# EAGLE design sherlock_anderson (EAGLE 6.5.0)
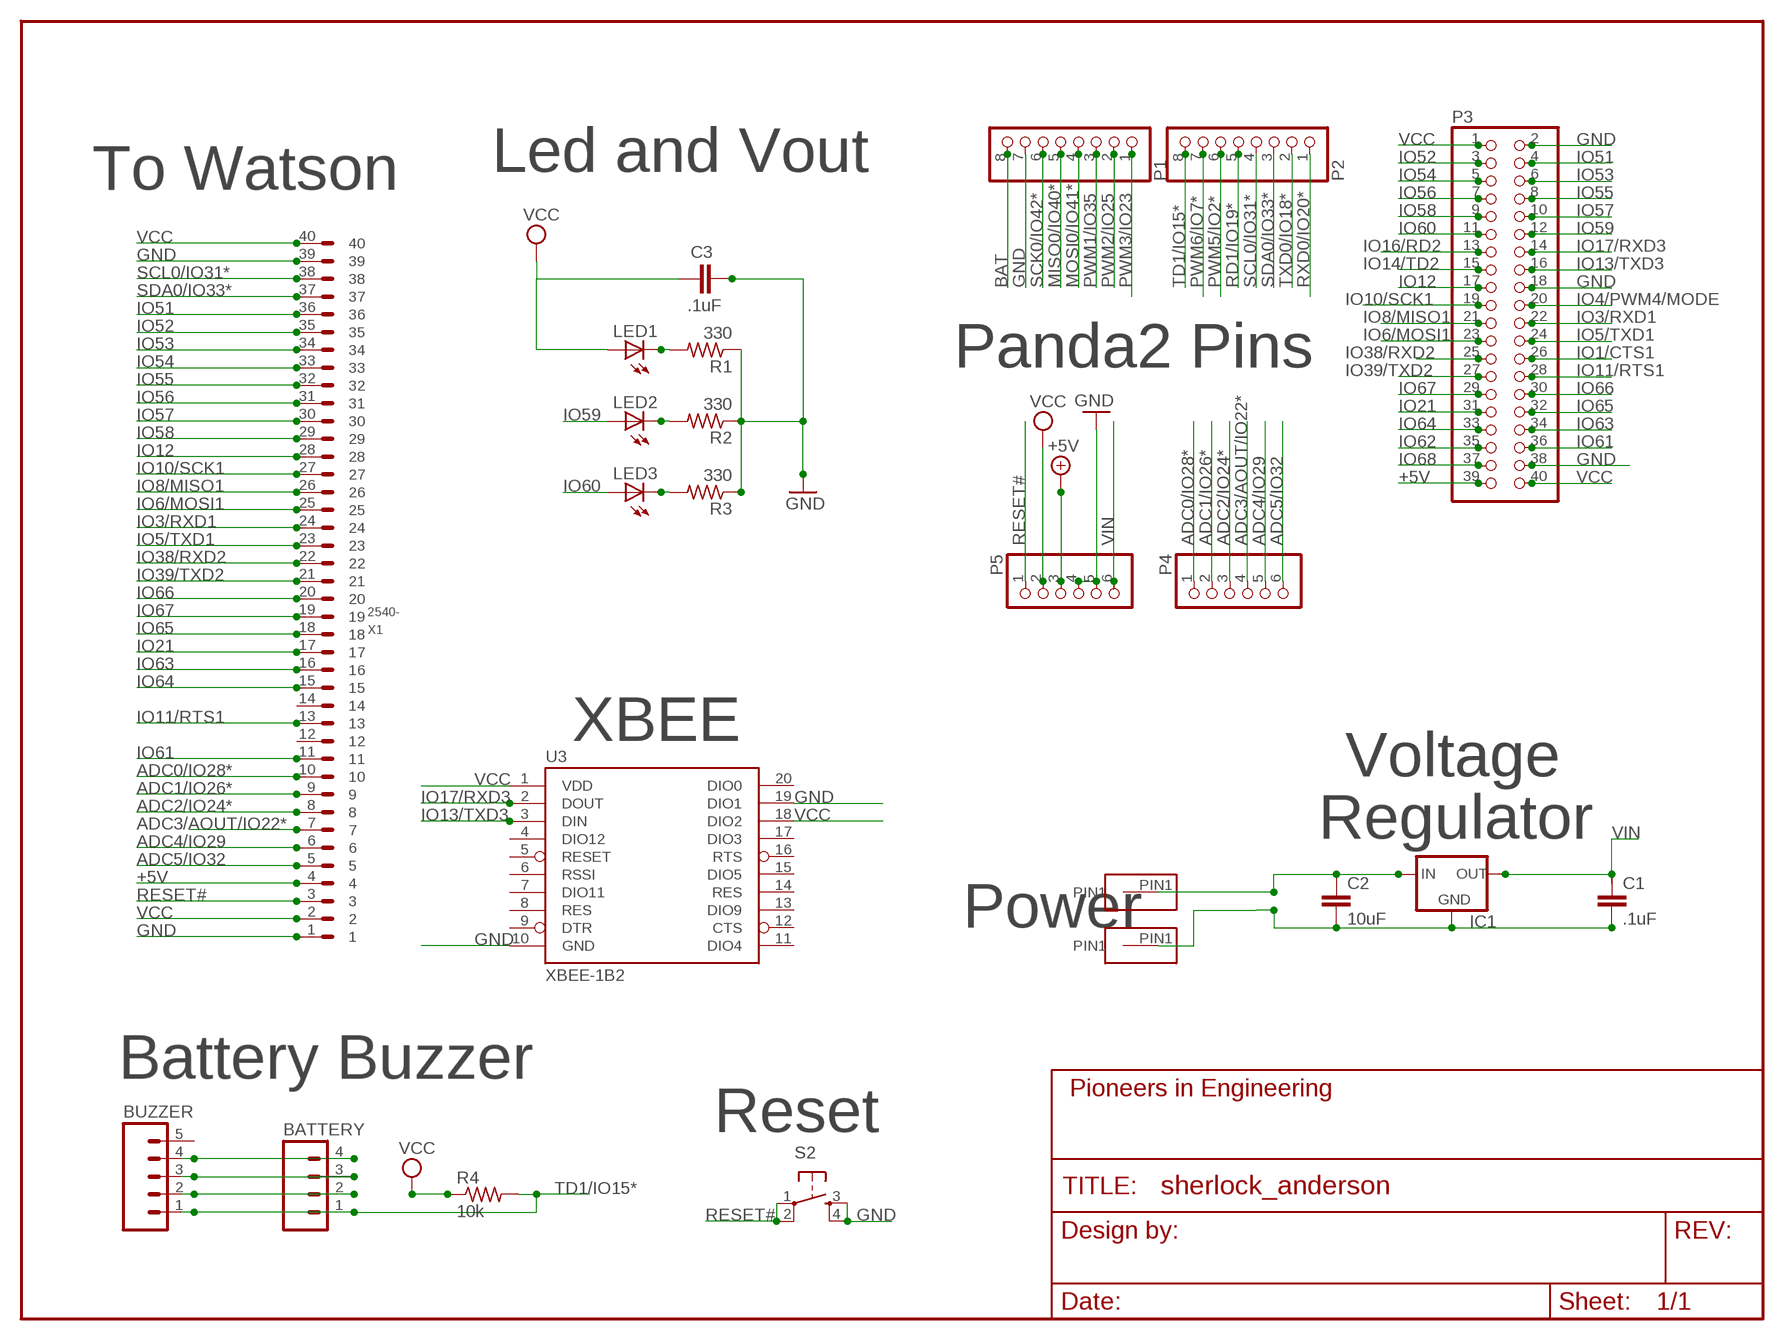
[diagram p0: schematic, sheet 1]
FRAME1 (FRAME-LETTER): AUTHOR: Sahar M., Michael C., Sumita G.; REVISION: F

## Parts
BATTERY  M041X04-MTA  [1X04-MTA]
BUZZER  M05PTH  [1X05]
C1  .1uF  CAP0603-CAP  [0603-CAP]
C2  10uF  CAP0603-CAP  [0603-CAP]
C3  .1uF  CAP0603-CAP  [0603-CAP]
IC1  V_REG_78XXSIDE  [78XXL]
LED1  LED0805  [LED-0805]
LED2  LED0805  [LED-0805]
LED3  LED0805  [LED-0805]
P1  PINHD-1X8  [1X08]
P2  PINHD-1X8  [1X08]
P3  PINHD-2X20  [2X20]
P4  PINHD-1X6  [1X06]
P5  PINHD-1X6  [1X06]
R1  330  R-US_R0603  [R0603]
R2  330  R-US_R0603  [R0603]
R3  330  R-US_R0603  [R0603]
R4  10k  R-US_R0603  [R0603]
S2  TAC_SWITCHPTH  [TACTILE-PTH]
U3  XBEE-1B2  [XBEE-SILK]
U$1  ANDERSON_RA_BOTTOM  [ANDERSON_RA_BOTTOM]
U$5  ANDERSON_RA_BOTTOM  [ANDERSON_RA_BOTTOM]
X1  2540-  [PAK100/2500-40]

## Nets
12V: C2.1 IC1.IN U$1.PIN1
+5V [power]: P3.39 P5.3 X1.4
ADC0/IO28*: P4.1 X1.10
ADC1/IO26*: P4.2 X1.9
ADC2/IO24*: P4.3 X1.8
ADC3/AOUT/IO22*: P4.4 X1.7
ADC4/IO29: P4.5 X1.6
ADC5/IO32: P4.6 X1.5
BAT: P1.8
GND: C1.2 C2.2 C3.2 IC1.GND P1.7 P3.2 P3.18 P3.38 P5.4 P5.5 R1.1 R2.1 R3.1 S2.3 S2.4 U3.10(GND) U3.19(DIO1) U$5.PIN1 X1.1 X1.39
IO1/CTS1: P3.26
IO3/RXD1: P3.22 X1.24
IO4/PWM4/MODE: P3.20
IO5/TXD1: P3.24 X1.23
IO6/MOSI1: P3.23 X1.25
IO8/MISO1: P3.21 X1.26
IO10/SCK1: P3.19 X1.27
IO11/RTS1: P3.28 X1.13
IO12: P3.17 X1.28
IO13/TXD3: P3.16 U3.3(DIN)
IO14/TD2: P3.15
IO16/RD2: P3.13
IO17/RXD3: P3.14 U3.2(DOUT)
IO21: P3.31 X1.17
IO38/RXD2: P3.25 X1.22
IO39/TXD2: P3.27 X1.21
IO51: P3.4 X1.36
IO52: P3.3 X1.35
IO53: P3.6 X1.34
IO54: P3.5 X1.33
IO55: P3.8 X1.32
IO56: P3.7 X1.31
IO57: P3.10 X1.30
IO58: P3.9 X1.29
IO59: LED2.A P3.12
IO60: LED3.A P3.11
IO61: P3.36 X1.11
IO62: P3.35
IO63: P3.34 X1.16
IO64: P3.33 X1.15
IO65: P3.32 X1.18
IO66: P3.30 X1.20
IO67: P3.29 X1.19
IO68: P3.37
MISO0/IO40*: P1.5
MOSI0/IO41*: P1.4
N$2: LED1.C R1.2
N$3: LED2.C R2.2
N$4: LED3.C R3.2
N$5: BATTERY.4 BUZZER.4
N$6: BATTERY.3 BUZZER.3
N$7: BATTERY.2 BUZZER.2
PWM1/IO35: P1.3
PWM2/IO25: P1.2
PWM3/IO23: P1.1
PWM5/IO2*: P2.6
PWM6/IO7*: P2.7
RD1/IO19*: P2.5
RESET#: P5.1 S2.1 S2.2 X1.3
RXD0/IO20*: P2.1
SCK0/IO42*: P1.6
SCL0/IO31*: P2.4 X1.38
SDA0/IO33*: P2.3 X1.37
TD1/IO15*: BATTERY.1 BUZZER.1 P2.8 R4.2
TXD0/IO18*: P2.2
VCC [power]: C3.1 LED1.A P3.1 P3.40 P5.2 R4.1 U3.1(VDD) U3.18(DIO2) X1.2 X1.40
VIN: C1.1 IC1.OUT P5.6
Unconnected: BUZZER.5 U3.4(DIO12) U3.5(RESET) U3.6(RSSI) U3.7(DIO11) U3.8(RES) U3.9(DTR) U3.11(DIO4) U3.12(CTS) U3.13(DIO9) U3.14(RES) U3.15(DIO5) U3.16(RTS) U3.17(DIO3) U3.20(DIO0) X1.12 X1.14

## Notes on the sheet
- To Watson | Led and Vout
- Panda2 Pins
- XBEE
- Voltage
- Regulator
- Power
- Battery Buzzer
- Reset

## Library data of the parts
BATTERY = pie:M04: 4-pin 0.1-inch header and MTA connector; PARTNUMBER: A1922-ND
BUZZER = pie:M05: 5-pin 0.1-inch header and MTA connector; PARTNUMBER: 965
C1-C3 = pie:CAP: Capacitor Standard 0603 ceramic capacitor, and 0.1" leaded capacitor.
IC1 = pie:V_REG_78XX: Voltage Regulator Standard 7805 5V regulator. IGO (Input Ground Output). Spark Fun Electronics SKU : COM-00107; PARTNUMBER: 497-1446-5-ND
LED1-LED3 = pie:LED: LEDs Standard schematic elements and footprints for 5mm, 3mm, 1206, and 0603 sized LEDs. 5mm - Spark Fun Electronics SKU : COM-00529 (and others)
P1 P2 = pie:PINHD-1X8: 8-pin 0.1-inch header; PARTNUMBER: 965
P3 = pie:PINHD-2X20: 2x20-pin 0.1-inch header; PARTNUMBER: 966
P4 P5 = pie:PINHD-1X6: 6-pin 0.1-inch header; PARTNUMBER: 965
R1-R4 = pie:R-US_: RESISTOR, American symbol
S2 = pie:TAC_SWITCH: Momentary Switch Button commonly used for reset or general input. Spark Fun Electronics SKU : COM-00097; PARTNUMBER: S5751-10-ND
U3 = pie:XBEE-1: XBee Header; PARTNUMBER: S5751-10-ND
U$1 U$5 = pie:ANDERSON_RA_BOTTOM
X1 = pie:2540-: 3M (TM) Pak 100 4-Wall Header Source: 3M; OC_FARNELL: unknown; OC_NEWARK: unknown; PARTNUMBER: S9175-ND

## Net classes
1 power: width 0.406 mm, drill 0.381 mm, clearance 0.203 mm

## Board
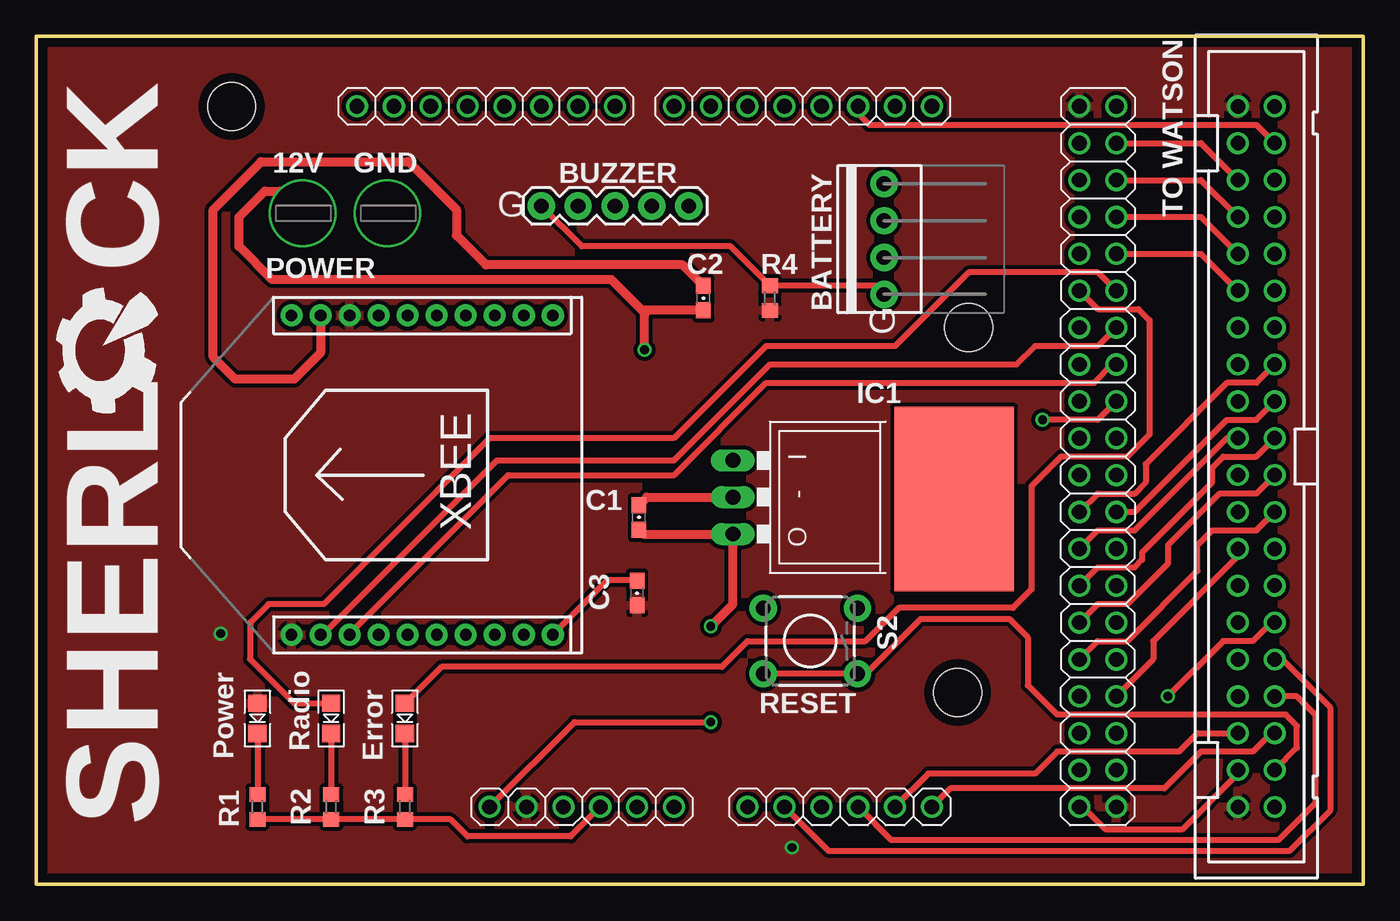
[diagram p1: board, top side]
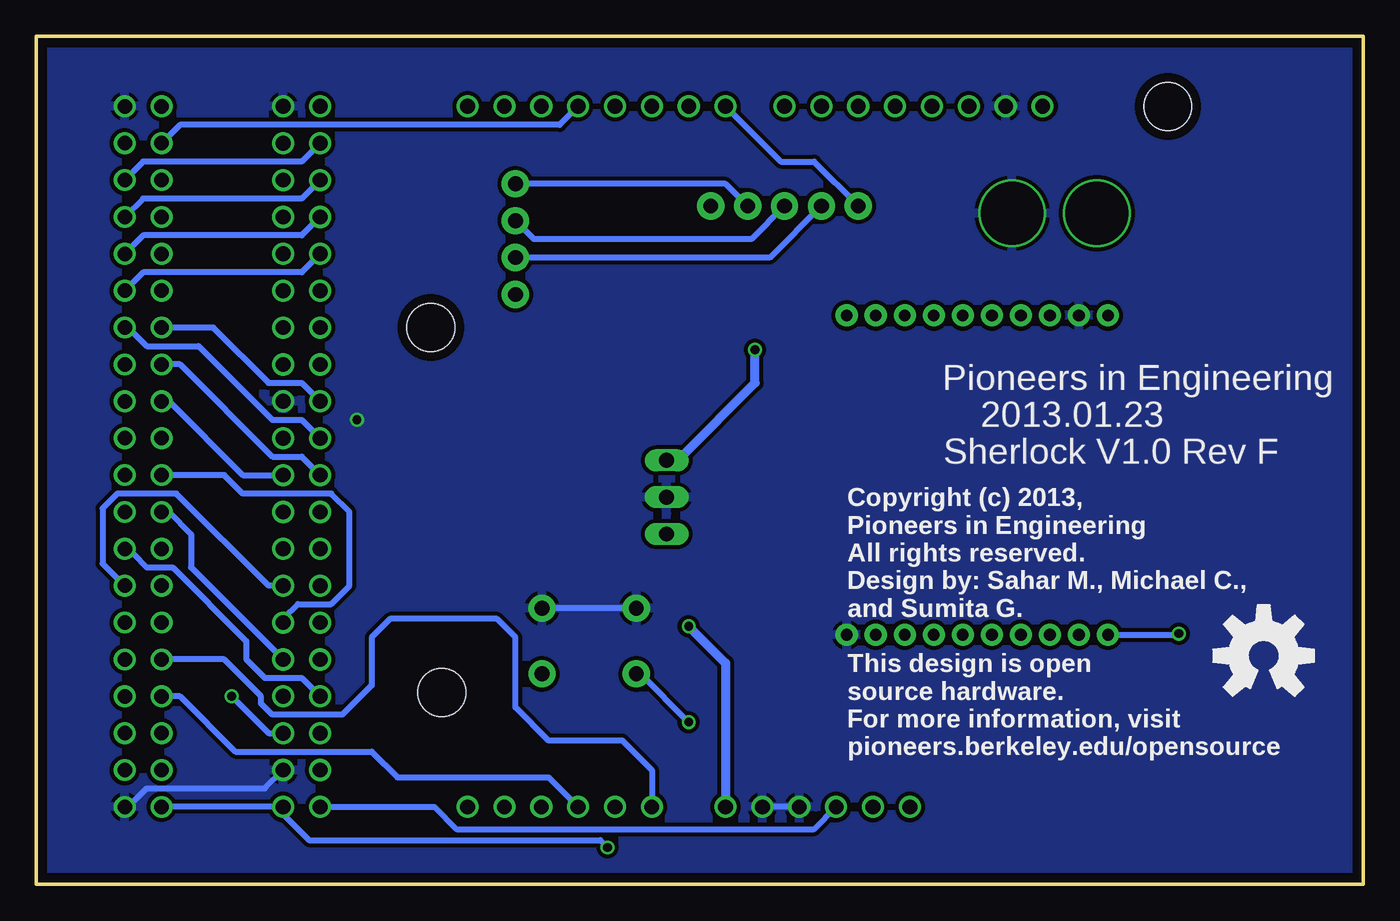
[diagram p2: board, bottom side, seen from below]

Size 91.44 x 58.42 mm. Coordinates in mm from the lower left corner, seen from the top.
Outline: 0,0 91.44,0 91.44,58.42 0,58.42 0,0
Copper layers (1*16): Top 2mil / dielectric 9mil / Bottom 2mil
Design rules "advancedcircuits-33each-pie": minimum track width 6mil, minimum drill 15mil, track to track 6mil, track to pad 10mil, pad to pad 6mil, via to via 6mil, smd to smd 6mil, copper to edge 25mil, drill to drill 7mil, minimum pad ring 7mil, minimum via ring 7mil, stop-mask expansion 3mil, vias tented up to drill 0mil, thermal gap 10mil

### Footprints (pad centres in the part's own frame; a part is rotated, then mirrored left to right if it is on the bottom)
1X04-MTA = drill 1.016 pad 1.88: 1 -3.81,0; 2 -1.27,0; 3 1.27,0; 4 3.81,0
1X05 = drill 1.016 pad 1.88: 1 -5.08,0; 2 -2.54,0; 3 0,0; 4 2.54,0; 5 5.08,0
0603-CAP = smd 1.1 x 1: 1 -0.85,0; 2 0.85,0
78XXL = drill 1.016 pad 1.524 long: GND 0,-8.89; IN -2.54,-8.89; OUT 2.54,-8.89 | smd 12.7 x 8.255: PAD 0.127,6.35
LED-0805 = smd 1.194 x 1.245: A -1.041,0; C 1.041,0
1X08 = drill 1.016 pad 1.524: 1 -8.89,0; 2 -6.35,0; 3 -3.81,0; 4 -1.27,0; 5 1.27,0; 6 3.81,0; 7 6.35,0; 8 8.89,0
2X20 = drill 1.016 pad 1.524: 1 -24.13,-1.27; 2 -24.13,1.27; 3 -21.59,-1.27; 4 -21.59,1.27; 5 -19.05,-1.27; 6 -19.05,1.27; 7 -16.51,-1.27; 8 -16.51,1.27; 9 -13.97,-1.27; 10 -13.97,1.27; 11 -11.43,-1.27; 12 -11.43,1.27; 13 -8.89,-1.27; 14 -8.89,1.27; 15 -6.35,-1.27; 16 -6.35,1.27; 17 -3.81,-1.27; 18 -3.81,1.27; 19 -1.27,-1.27; 20 -1.27,1.27; 21 1.27,-1.27; 22 1.27,1.27; 23 3.81,-1.27; 24 3.81,1.27; 25 6.35,-1.27; 26 6.35,1.27; 27 8.89,-1.27; 28 8.89,1.27; 29 11.43,-1.27; 30 11.43,1.27; 31 13.97,-1.27; 32 13.97,1.27; 33 16.51,-1.27; 34 16.51,1.27; 35 19.05,-1.27; 36 19.05,1.27; 37 21.59,-1.27; 38 21.59,1.27; 39 24.13,-1.27; 40 24.13,1.27
1X06 = drill 1.016 pad 1.524: 1 -6.35,0; 2 -3.81,0; 3 -1.27,0; 4 1.27,0; 5 3.81,0; 6 6.35,0
R0603 = smd 1 x 1.1: 1 -0.85,0; 2 0.85,0
TACTILE-PTH = drill 1.016 pad 1.88: 1 -3.251,2.261; 2 3.251,2.261; 3 -3.251,-2.261; 4 3.251,-2.261
XBEE-SILK = drill 0.8 pad 1.524: 1 -11,6.03; 2 -11,4.03; 3 -11,2.03; 4 -11,0.03; 5 -11,-1.97; 6 -11,-3.97; 7 -11,-5.97; 8 -11,-7.97; 9 -11,-9.97; 10 -11,-11.97; 11 11,-11.97; 12 11,-9.97; 13 11,-7.97; 14 11,-5.97; 15 11,-3.97; 16 11,-1.97; 17 11,0.03; 18 11,2.03; 19 11,4.03; 20 11,6.03
ANDERSON_RA_BOTTOM = drill 4.318: PIN1 1.841,0.508
STAND-OFF = hole 3.302: 0,0
PAK100/2500-40 = drill 1 pad 1.5: 1 -24.13,-1.27; 2 -24.13,1.27; 3 -21.59,-1.27; 4 -21.59,1.27; 5 -19.05,-1.27; 6 -19.05,1.27; 7 -16.51,-1.27; 8 -16.51,1.27; 9 -13.97,-1.27; 10 -13.97,1.27; 11 -11.43,-1.27; 12 -11.43,1.27; 13 -8.89,-1.27; 14 -8.89,1.27; 15 -6.35,-1.27; 16 -6.35,1.27; 17 -3.81,-1.27; 18 -3.81,1.27; 19 -1.27,-1.27; 20 -1.27,1.27; 21 1.27,-1.27; 22 1.27,1.27; 23 3.81,-1.27; 24 3.81,1.27; 25 6.35,-1.27; 26 6.35,1.27; 27 8.89,-1.27; 28 8.89,1.27; 29 11.43,-1.27; 30 11.43,1.27; 31 13.97,-1.27; 32 13.97,1.27; 33 16.51,-1.27; 34 16.51,1.27; 35 19.05,-1.27; 36 19.05,1.27; 37 21.59,-1.27; 38 21.59,1.27; 39 24.13,-1.27; 40 24.13,1.27

### Placement (x,y rotation side)
BATTERY  58.42,44.45 90 top
BUZZER  39.88,46.74 0 top
C1  41.53,25.27 90 top
C2  45.97,40.39 90 top
C3  41.4,20.07 90 top
IC1  56.9,26.67 270 top
LED1  15.24,11.43 270 top
LED2  20.32,11.43 270 top
LED3  25.4,11.43 270 top
P1  30.99,53.59 180 top
P2  52.83,53.59 180 top
P3  73.15,29.46 270 top
P4  55.37,5.33 0 top
P5  37.59,5.33 0 top
R1  15.24,5.33 90 top
R2  20.32,5.33 90 top
R3  25.4,5.33 90 top
R4  50.55,40.39 90 top
S2  53.34,16.76 180 top
U3  23.62,28.19 90 top
U$1  16.51,45.72 0 top
U$2  [SHERLOCK]  8.38,4.06 90 top
U$3  Mounting + Test  [STAND-OFF]  13.46,53.59 0 top
U$4  Mounting  [STAND-OFF]  64.26,38.35 0 top
U$5  22.35,45.72 0 top
U$6  Test  [STAND-OFF]  63.5,13.21 0 top
U$7  [OSHW-LOGO-L]  6.86,15.75 0 bottom
X1  84.07,29.46 90 top

### Tracks (layer width: path | path; a pad name or v marks a point on that pad's centre or on a via)
12V  (via drill 0.6)
  Top 0.61: C2.1 42.16,39.54 | 42.16,39.54 41.74,39.54 39.62,41.66 16.26,41.66 13.97,43.94 13.97,45.97 15.75,47.75 16.83,47.75 U$1.PIN1 | v41.91,36.83 41.91,39.28 42.16,39.54
  Bottom 0.406: 47.75,29.46 47.5,29.46
  Bottom 0.61: IC1.IN 47.75,29.46 | 47.5,29.46 46.99,29.46 41.91,34.54 v41.91,36.83
+5V
  Top 0.406: P3.39 72.14,5.33 73.66,3.81 78.99,3.81 82.68,7.49 82.8,7.49 X1.4
  Bottom 0.406: P3.39 64.01,5.33 62.48,3.81 37.85,3.81 P5.3
ADC0/IO28*
  Bottom 0.406: P4.1 49.02,7.87 51.05,9.91 56.13,9.91 58.42,12.19 58.42,17.02 59.69,18.29 67.06,18.29 68.33,17.02 68.33,13.72 70.36,11.68 75.18,11.68 75.95,12.45 75.95,12.95 78.49,15.49 X1.10
ADC1/IO26*
  Top 0.406: P4.2 54.61,2.29 86.36,2.29 89.15,5.08 89.15,12.19 85.85,15.49 X1.9
ADC2/IO24*
  Bottom 0.406: P4.3 56.13,7.37 66.55,7.37 68.33,9.14 77.72,9.14 81.53,12.95 X1.8
ADC3/AOUT/IO22*
  Top 0.406: P4.4 58.93,3.05 85.6,3.05 88.14,5.59 88.14,11.68 86.87,12.95 X1.7
ADC4/IO29
  Top 0.406: 59.18,5.08 P4.5 | 59.18,5.59 P4.5 | P4.5 61.47,7.62 68.83,7.62 70.36,9.14 78.74,9.14 80.01,10.41 X1.6
ADC5/IO32
  Top 0.406: P4.6 62.99,6.6 77.72,6.6 80.26,9.14 83.82,9.14 85.09,10.41 X1.5
GND  (via drill 0.6)
  Top 0.406: P3.18 73.15,32 v69.34,32 | P5.4 36.83,3.3 29.72,3.3 28.54,4.48 R3.1 R2.1 R1.1 | C3.2 41.38,20.94 39.34,20.94 U3.10
  Top 0.61: C1.2 42.08,26.67 IC1.GND | C2.2 44.54,42.67 30.99,42.67 28.96,44.7 28.96,46.48 25.65,49.78 15.49,49.78 12.19,46.48 12.19,36.32 13.72,34.8 17.78,34.8 19.59,36.61 U3.19
  Bottom 0.406: P5.4 P5.5 | 85.09,5.33 83.82,6.6 75.69,6.6 P3.38 | S2.4 S2.3
  pour Bottom (isolate 0.279): 0,0 91.44,0 91.44,58.42 0,58.42
IO3/RXD1
  Bottom 0.406: P3.22 77.22,28.19 82.3,33.27 X1.24
IO5/TXD1
  Top 0.406: P3.24 75.69,25.65 82.04,32 84.07,32 X1.23
IO6/MOSI1
  Top 0.406: X1.25 84.07,34.54 82.04,34.54 76.45,28.96 76.45,27.69 75.69,26.92 73.15,26.92 P3.23
IO8/MISO1
  Bottom 0.406: P3.21 73.15,29.46 75.18,29.46 81.53,35.81 X1.26
IO10/SCK1
  Bottom 0.406: P3.19 73.15,32 75.18,32 80.26,37.08 83.82,37.08 85.09,38.35 X1.27
IO11/RTS1
  Bottom 0.406: P3.28 75.44,20.57 81.79,26.92 85.85,26.92 86.87,25.91 86.87,22.1 X1.13
IO12
  Bottom 0.406: P3.17 73.15,34.54 75.44,34.54 79.25,38.35 X1.28
IO13/TXD3
  Top 0.406: U3.3 21.59,17.27 32.51,28.19 43.94,28.19 50.29,34.54 72.9,34.54 74.17,35.81 P3.16
IO17/RXD3
  Top 0.406: P3.14 73.15,37.08 68.83,37.08 67.56,35.81 50.55,35.81 43.94,29.21 31.75,29.21 19.73,17.19 U3.2
IO21
  Top 0.406: P3.31 73.15,16.76 75.18,16.76 80.01,21.59 80.01,23.37 81.03,24.38 84.07,24.38 X1.17
IO38/RXD2
  Top 0.406: P3.25 73.15,24.38 75.69,24.38 82.04,30.73 X1.22
IO39/TXD2
  Top 0.406: P3.27 73.15,21.84 75.69,21.84 76.2,22.35 76.2,22.86 81.03,27.69 81.03,28.7 81.79,29.46 84.07,29.46 X1.21
IO51
  Top 0.406: P3.4 80.26,51.05 X1.36
IO52
  Bottom 0.406: P3.3 73.15,49.78 84.07,49.78 X1.35
IO53
  Top 0.406: P3.6 80.26,48.51 X1.34
IO54
  Bottom 0.406: P3.5 73.15,47.24 84.07,47.24 X1.33
IO55
  Top 0.406: P3.8 80.26,45.97 X1.32
IO56
  Bottom 0.406: P3.7 73.15,44.7 84.07,44.7 X1.31
IO57
  Top 0.406: P3.10 80.26,43.43 X1.30
IO58
  Bottom 0.406: P3.9 73.15,42.16 84.07,42.16 X1.29
IO59
  Top 0.406: P3.12 73.15,42.16 64.26,42.16 59.18,37.08 50.29,37.08 43.94,30.73 31.24,30.73 19.81,19.3 16,19.3 14.73,18.03 14.73,15.52 17.78,12.47 LED2.A
IO60
  Top 0.406: P3.11 73.15,39.62 75.95,39.62 76.71,38.86 76.71,30.99 75.18,29.46 70.61,29.46 68.58,27.43 68.58,20.32 67.31,19.05 59.44,19.05 57.15,16.76 49.02,16.76 47.24,14.99 27.91,14.99 LED3.A
IO61  (via drill 0.6)
  Top 0.406: v77.98,12.95 81.79,16.76 83.82,16.76 85.09,18.03 X1.11
  Bottom 0.406: v77.98,12.95 75.44,10.41 P3.36
IO63
  Top 0.406: P3.34 76.96,15.49 76.96,16.76 82.68,22.48 82.68,22.99 X1.16
IO64
  Bottom 0.406: P3.33 73.15,14.22 75.69,14.22 76.96,15.49 76.96,16.76 82.04,21.84 83.82,21.84 84.71,22.73 84.96,22.73 X1.15
IO65
  Bottom 0.406: P3.32 80.77,21.84 80.77,24.13 82.3,25.65 X1.18
IO66
  Bottom 0.406: P3.30 74.42,18.29 73.41,19.3 71.12,19.3 69.85,20.57 69.85,25.65 71.12,26.92 77.22,26.92 78.49,28.19 X1.20
IO67
  Top 0.406: P3.29 73.15,19.3 75.18,19.3 77.98,22.1 77.98,23.37 81.53,26.92 84.07,26.92 X1.19
N$2
  Top 0.406: LED1.C R1.2
N$3
  Top 0.406: LED2.C R2.2
N$4
  Top 0.406: LED3.C R3.2
N$5
  Bottom 0.406: BUZZER.4 43.94,48.26 BATTERY.4
N$6
  Bottom 0.406: BUZZER.3 42.16,44.45 57.15,44.45 BATTERY.3
N$7
  Bottom 0.406: BUZZER.2 40.89,43.18 BATTERY.2
RESET#  (via drill 0.6)
  Top 0.406: P5.1 37.08,11.18 v46.48,11.18 | X1.3 86.87,9.4 86.87,10.92 86.11,11.68 70.36,11.68 68.33,13.72 68.33,17.02 67.06,18.29 60.96,18.29 57.17,14.5 S2.1 S2.2
  Bottom 0.406: v46.48,11.18 49.81,14.5 S2.2
SCL0/IO31*
  Bottom 0.406: P2.4 55.37,52.32 81.53,52.32 X1.38
SDA0/IO33*
  Top 0.406: P2.3 56.64,53.09 57.4,52.32 84.07,52.32 X1.37
TD1/IO15*
  Top 0.406: BUZZER.1 37.59,43.94 47.84,43.94 R4.2 57.82,41.24 BATTERY.1
  Bottom 0.406: P2.8 40.13,49.78 37.85,49.78 BUZZER.1
VCC  (via drill 0.6)
  Top 0.406: v52.07,2.54 52.07,2.79
  Bottom 0.406: v52.07,2.54 52.58,3.05 72.64,3.05 74.42,4.83 P3.40 X1.2 | U3.1 12.78,17.19 v12.7,17.27
  pour Top (isolate 0.279): 0,0 91.44,0 91.44,58.42 0,58.42
VIN  (via drill 0.6)
  Top 0.61: v46.48,17.78 48.01,19.3 IC1.OUT 41.82,24.13 C1.1
  Bottom 0.61: v46.48,17.78 43.94,15.24 P5.6

### Text on the board
tPlace: G | TO WATSON | POWER | G | Radio | RESET | Power | Error
bPlace: Pioneers in Engineering | 2013.01.23 | Sherlock V1.0 Rev F | Copyright (c) 2013, / Pioneers in Engineering / All rights reserved. / Design by: Sahar M., Michael C., / and Sumita G. / / This design is open / source hardware. / For more information, visit / pioneers.berkeley.edu/opensource
_tsilk: 12V | GND